# Altium schematic sheet RA8D2 MCU - Power.SchDoc
size A3; Company Name: Renesas Electronics America; CompanyURL: www.renesas.com; PageSetup: Record=PageOptions|CenterHorizontal=True|CenterVertical=True|PrintScale=1.00|XCorrection=1.00|YCorrection=1.00|PrintKind=1|BorderSize=5000000|LeftOffset=0|BottomOffset=0|Orientation=2|PaperLength=1000|PaperWidth=1000|Scale=100|PaperSource=7|PrintQuality=-4|MediaType=1|DitherType=10|PaperKind=A5 148x210mm|PrintScaleMode=1; ReleaseDate: 16.09.2025; Version: MP; SheetNumber: 10; SheetTotal: 18; VariantNumber: 0; DSheetNumber: 1
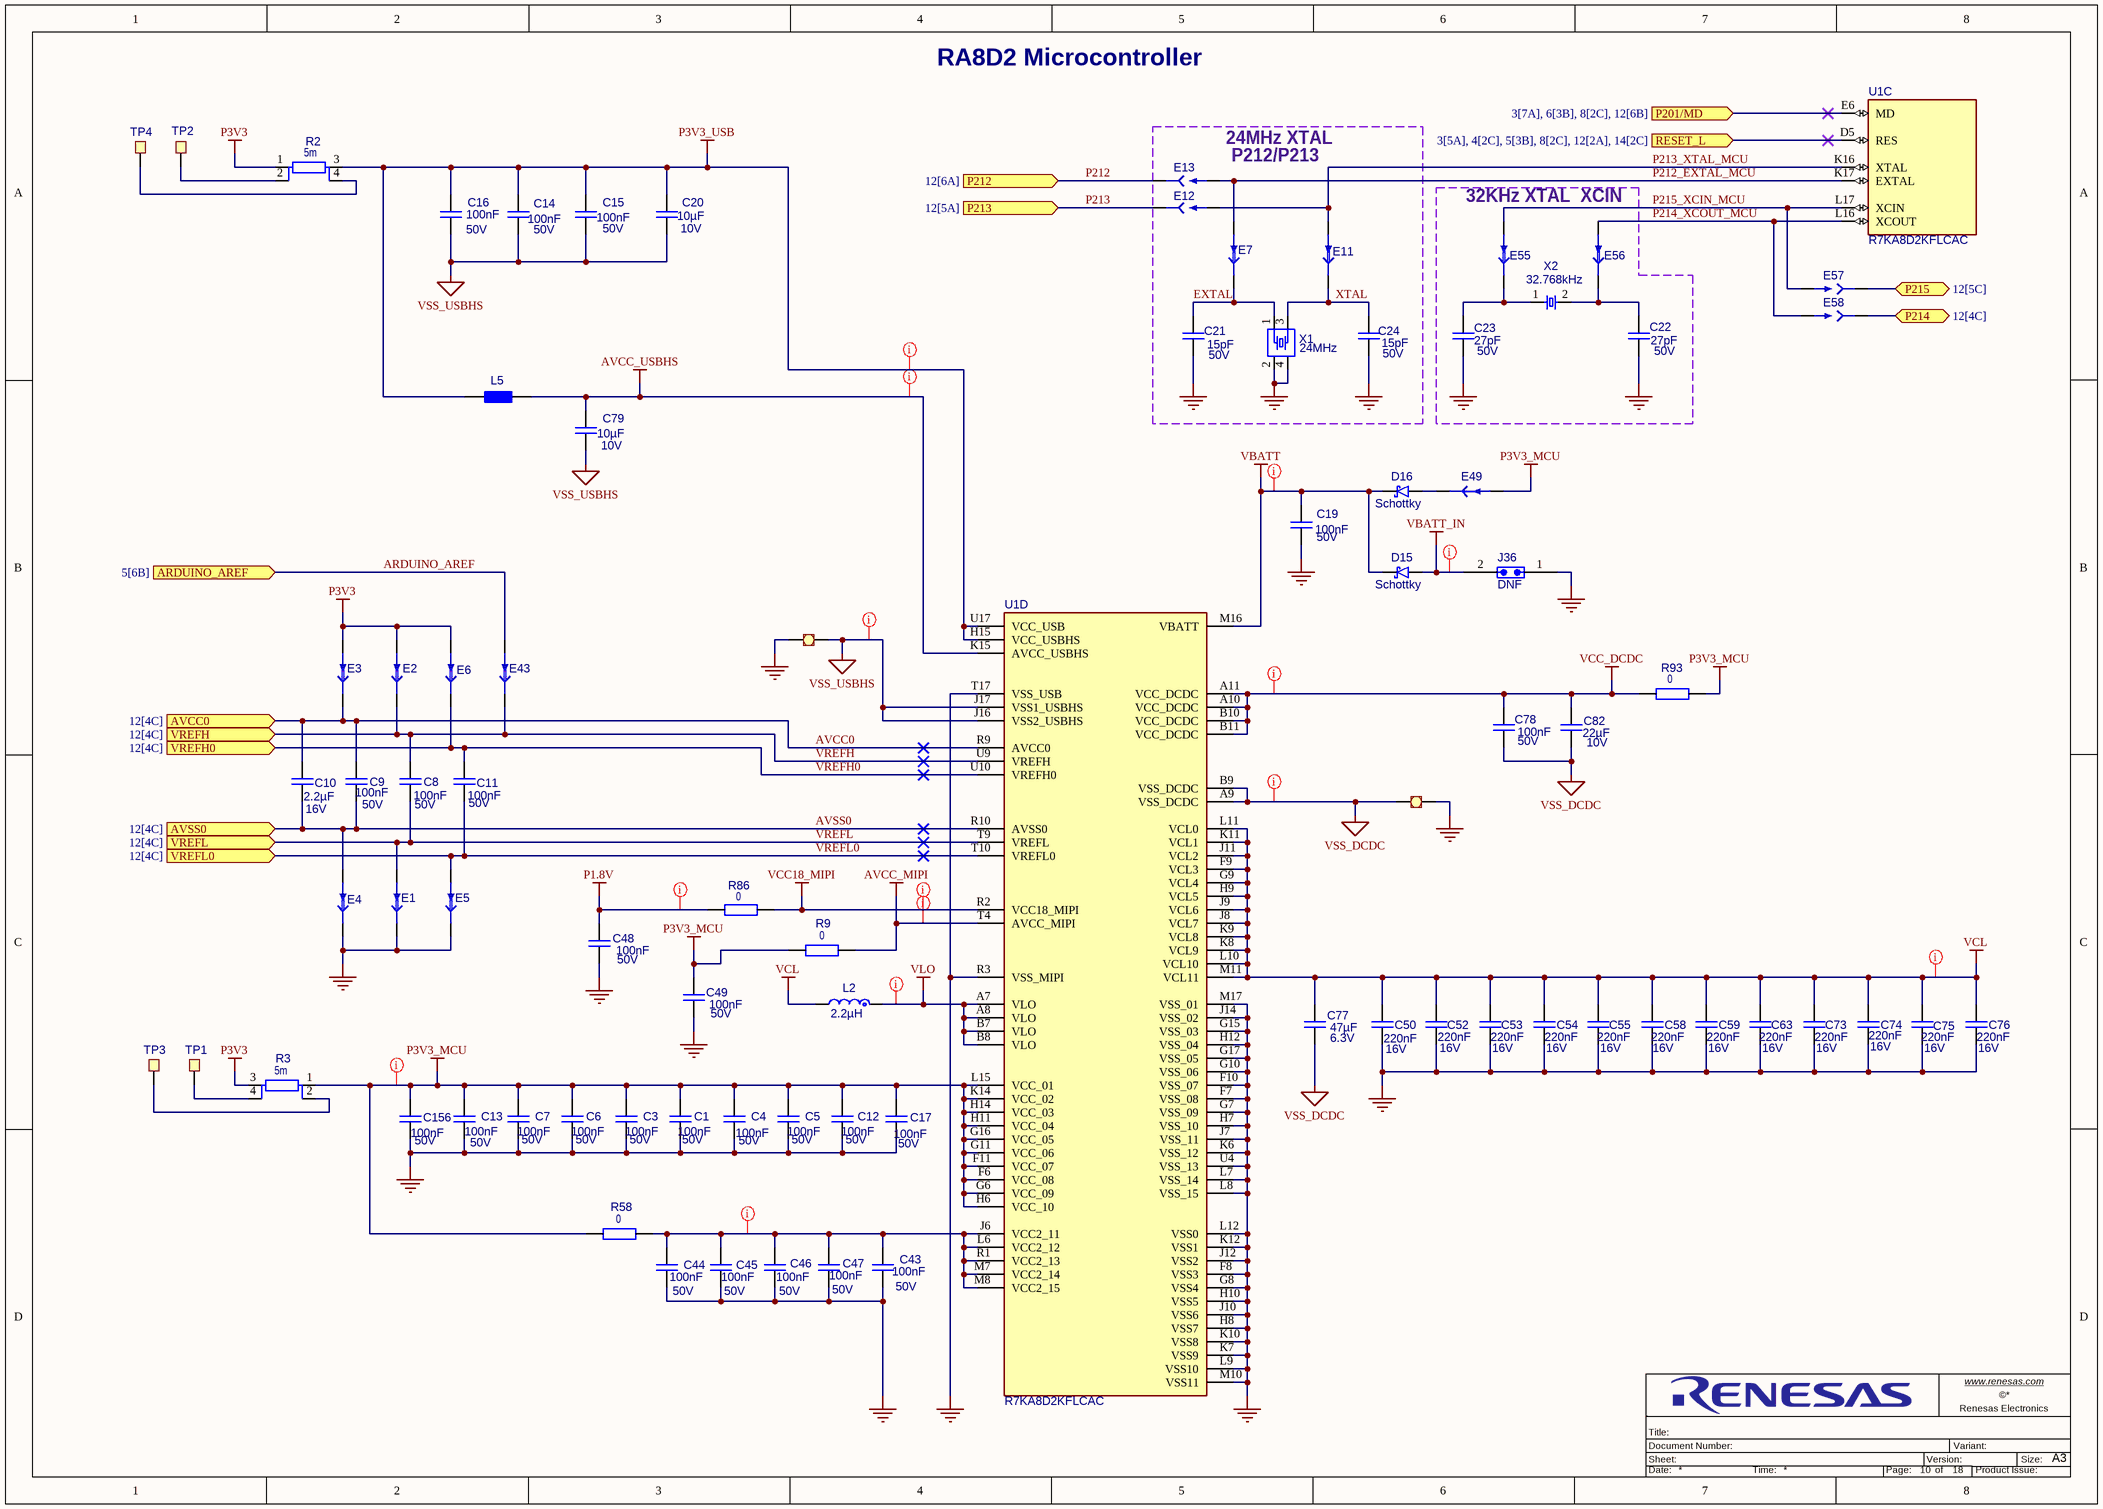
[diagram p0: RA8D2 MCU - Power.SchDoc]

## Parts
C1  value 100nF  Operating Voltage Max: 50V  [C_EIA0402_0p55]  (hidden comment: Capacitor)
C3  value 100nF  Operating Voltage Max: 50V  [C_EIA0402_0p55]  (hidden comment: Capacitor)
C4  value 100nF  Operating Voltage Max: 50V  [C_EIA0402_0p55]  (hidden comment: Capacitor)
C5  value 100nF  Operating Voltage Max: 50V  [C_EIA0402_0p55]  (hidden comment: Capacitor)
C6  value 100nF  Operating Voltage Max: 50V  [C_EIA0402_0p55]  (hidden comment: Capacitor)
C7  value 100nF  Operating Voltage Max: 50V  [C_EIA0402_0p55]  (hidden comment: Capacitor)
C8  value 100nF  Operating Voltage Max: 50V  [C_EIA0402_0p55]  (hidden comment: Capacitor)
C9  value 100nF  Operating Voltage Max: 50V  [C_EIA0402_0p55]  (hidden comment: Capacitor)
C10  value 2.2µF  Operating Voltage Max: 16V  [C_EIA0402_0p7]  (hidden comment: Capacitor)
C11  value 100nF  Operating Voltage Max: 50V  [C_EIA0402_0p55]  (hidden comment: Capacitor)
C12  value 100nF  Operating Voltage Max: 50V  [C_EIA0402_0p55]  (hidden comment: Capacitor)
C13  value 100nF  Operating Voltage Max: 50V  [C_EIA0402_0p55]  (hidden comment: Capacitor)
C14  value 100nF  Operating Voltage Max: 50V  [C_EIA0402_0p55]  (hidden comment: Capacitor)
C15  value 100nF  Operating Voltage Max: 50V  [C_EIA0402_0p55]  (hidden comment: Capacitor)
C16  value 100nF  Operating Voltage Max: 50V  [C_EIA0402_0p55]  (hidden comment: Capacitor)
C17  value 100nF  Operating Voltage Max: 50V  [C_EIA0402_0p55]  (hidden comment: Capacitor)
C19  value 100nF  Operating Voltage Max: 50V  [C_EIA0402_0p55]  (hidden comment: Capacitor)
C20  value 10µF  Operating Voltage Max: 10V  [C_EIA0402_0p7]  (hidden comment: Capacitor)
C21  value 15pF  Operating Voltage Max: 50V  [C_EIA0201_0p4]  (hidden comment: Capacitor)
C22  value 27pF  Operating Voltage Max: 50V  [C_EIA0402_0p55]  (hidden comment: Capacitor)
C23  value 27pF  Operating Voltage Max: 50V  [C_EIA0402_0p55]  (hidden comment: Capacitor)
C24  value 15pF  Operating Voltage Max: 50V  [C_EIA0201_0p4]  (hidden comment: Capacitor)
C43  value 100nF  Operating Voltage Max: 50V  [C_EIA0402_0p55]  (hidden comment: Capacitor)
C44  value 100nF  Operating Voltage Max: 50V  [C_EIA0402_0p55]  (hidden comment: Capacitor)
C45  value 100nF  Operating Voltage Max: 50V  [C_EIA0402_0p55]  (hidden comment: Capacitor)
C46  value 100nF  Operating Voltage Max: 50V  [C_EIA0402_0p55]  (hidden comment: Capacitor)
C47  value 100nF  Operating Voltage Max: 50V  [C_EIA0402_0p55]  (hidden comment: Capacitor)
C48  value 100nF  Operating Voltage Max: 50V  [C_EIA0402_0p55]  (hidden comment: Capacitor)
C49  value 100nF  Operating Voltage Max: 50V  [C_EIA0402_0p55]  (hidden comment: Capacitor)
C50  value 220nF  Operating Voltage Max: 16V  [C_EIA0402_0p55]  (hidden comment: Capacitor)
C52  value 220nF  Operating Voltage Max: 16V  [C_EIA0402_0p55]  (hidden comment: Capacitor)
C53  value 220nF  Operating Voltage Max: 16V  [C_EIA0402_0p55]  (hidden comment: Capacitor)
C54  value 220nF  Operating Voltage Max: 16V  [C_EIA0402_0p55]  (hidden comment: Capacitor)
C55  value 220nF  Operating Voltage Max: 16V  [C_EIA0402_0p55]  (hidden comment: Capacitor)
C58  value 220nF  Operating Voltage Max: 16V  [C_EIA0402_0p55]  (hidden comment: Capacitor)
C59  value 220nF  Operating Voltage Max: 16V  [C_EIA0402_0p55]  (hidden comment: Capacitor)
C63  value 220nF  Operating Voltage Max: 16V  [C_EIA0402_0p55]  (hidden comment: Capacitor)
C73  value 220nF  Operating Voltage Max: 16V  [C_EIA0402_0p55]  (hidden comment: Capacitor)
C74  value 220nF  Operating Voltage Max: 16V  [C_EIA0402_0p55]  (hidden comment: Capacitor)
C75  value 220nF  Operating Voltage Max: 16V  [C_EIA0402_0p55]  (hidden comment: Capacitor)
C76  value 220nF  Operating Voltage Max: 16V  [C_EIA0402_0p55]  (hidden comment: Capacitor)
C77  value 47µF  Operating Voltage Max: 6.3V  [C_EIA1206_1p8]  (hidden comment: GRM31CE70J476ME15L)
C78  value 100nF  Operating Voltage Max: 50V  [C_EIA0402_0p55]  (hidden comment: Capacitor)
C79  value 10µF  Operating Voltage Max: 10V  [C_EIA0402_0p7]  (hidden comment: Capacitor)
C82  value 22µF  Operating Voltage Max: 10V  [C_EIA1206_1p8]  (hidden comment: Capacitor)
C156  value 100nF  Operating Voltage Max: 50V  [C_EIA0402_0p55]  (hidden comment: Capacitor)
D15  Schottky  [roh_sod-123fl_pmdu]
D16  Schottky  [roh_sod-123fl_pmdu]
E1  TRACE_CUT_0805  [trace_cut_0805]  (value not drawn)  (net tie, no BOM)
E2  TRACE_CUT_0805  [trace_cut_0805]  (value not drawn)  (net tie, no BOM)
E3  TRACE_CUT_0805  [trace_cut_0805]  (value not drawn)  (net tie, no BOM)
E4  TRACE_CUT_0805  [trace_cut_0805]  (value not drawn)  (net tie, no BOM)
E5  TRACE_CUT_0805  [trace_cut_0805]  (value not drawn)  (net tie, no BOM)
E6  TRACE_CUT_0805  [trace_cut_0805]  (value not drawn)  (net tie, no BOM)
E7  TRACE_CUT_0805  [trace_cut_0805]  (value not drawn)  (net tie, no BOM)
E11  TRACE_CUT_0805  [trace_cut_0805]  (value not drawn)  (net tie, no BOM)
E12  SOLDER_BRIDGE_0805  [solder_bridge_0805]  (value not drawn)  (no BOM)
E13  SOLDER_BRIDGE_0805  [solder_bridge_0805]  (value not drawn)  (no BOM)
E43  TRACE_CUT_0805  [trace_cut_0805]  (value not drawn)  (net tie, no BOM)
E49  TRACE_CUT_0805  [trace_cut_0805]  (value not drawn)  (net tie, no BOM)
E55  TRACE_CUT_0805  [trace_cut_0805]  (value not drawn)  (net tie, no BOM)
E56  TRACE_CUT_0805  [trace_cut_0805]  (value not drawn)  (net tie, no BOM)
E57  SOLDER_BRIDGE_0805  [solder_bridge_0805]  (value not drawn)  (no BOM)
E58  SOLDER_BRIDGE_0805  [solder_bridge_0805]  (value not drawn)  (no BOM)
FS1  FS_Trace_120um  [force_sense_120um]  (value not drawn)  (net tie, no BOM)
FS2  FS_Trace_120um  [force_sense_120um]  (value not drawn)  (net tie, no BOM)
J36  CON_002  [wue_61300211121]  (value not drawn)
L2  value 2.2µH  [tdk_spm5020-lr]  (hidden comment: Inductor)
L5  MPZ1005S121CT000  [L_EIA0402]  (value not drawn)
R2  value 5m  [R_EIA0612]  (hidden comment: PS0612FKE070R005L)
R3  value 5m  [R_EIA0612]  (hidden comment: PS0612FKE070R005L)
R9  value 0  [R_EIA1206]  (hidden comment: Resistor)
R58  value 0  [R_EIA1206]  (hidden comment: Resistor)
R86  value 0  [R_EIA1206]  (hidden comment: Resistor)
R93  value 0  [R_EIA1206]  (hidden comment: Resistor)
TP1  TP_Mini  [key_5019]  (value not drawn)
TP2  TP_Mini  [key_5019]  (value not drawn)
TP3  TP_Mini  [key_5019]  (value not drawn)
TP4  TP_Mini  [key_5019]  (value not drawn)
U1  R7KA8D2KFLCAC  [ren_bga289_PRBG0289JA-A]  (parts C,D of 6)
X1  value 24MHz  [dio_FL]  (hidden comment: FL2400022)
X2  value 32.768kHz  [ABR_ABS07]  (hidden comment: ABS07-32.768KHZ-1-T)

## Blocks framed on the sheet
32KHz XTAL  XCIN: C22 C23 E55 E56 X2

## Ports
ARDUINO_AREF (in, see 5[6B]), AVCC0 (in, see 12[4C]), AVSS0 (in, see 12[4C]), P201/MD (in, see 3[7A], 6[3B], 8[2C], 12[6B]), P212 (in, see 12[6A]), P213 (in, see 12[5A]), P214 (bidir, see 12[4C]), P215 (bidir, see 12[5C]), RESET_L (in, see 3[5A], 4[2C], 5[3B], 8[2C], 12[2A], 14[2C]), VREFH0 (in, see 12[4C]), VREFH (in, see 12[4C]), VREFL0 (in, see 12[4C]), VREFL (in, see 12[4C])

## Nets
AVCC_MIPI: R9.2 U1.T4(AVCC_MIPI)
AVCC_USBHS: C79.1 L5.1 U1.K15(AVCC_USBHS)
GND: C1.1 C3.1 C4.1 C5.1 C6.1 C7.1 C12.1 C13.1 C17.1 C19.2 C21.2 C22.2 C23.2 C24.2 C43.1 C44.1 C45.1 C46.1 C47.1 C48.2 C49.2 C50.2 C52.2 C53.2 C54.2 C55.2 C58.2 C59.2 C63.2 C73.2 C74.2 C75.2 C76.2 C156.1 E1.1 E4.1 E5.1 FS1.1 FS2.2 J36.1 U1.F7(VSS_08) U1.F8(VSS3) U1.F10(VSS_07) U1.G7(VSS_09) U1.G8(VSS4) U1.G10(VSS_06) U1.G15(VSS_03) U1.G17(VSS_05) U1.H7(VSS_10) U1.H8(VSS7) U1.H10(VSS5) U1.H12(VSS_04) U1.J7(VSS_11) U1.J10(VSS6) U1.J12(VSS2) U1.J14(VSS_02) U1.K6(VSS_12) U1.K7(VSS9) U1.K10(VSS8) U1.K12(VSS1) U1.L7(VSS_14) U1.L8(VSS_15) U1.L9(VSS10) U1.L12(VSS0) U1.M10(VSS11) U1.M17(VSS_01) U1.R3(VSS_MIPI) U1.T17(VSS_USB) U1.U4(VSS_13) X1.2 X1.4
P1.8V: C48.1 R86.1
P3V3: E2.2 E3.2 E6.2 R2.1 R3.3
P3V3_MCU: C1.2 C3.2 C4.2 C5.2 C6.2 C7.2 C12.2 C13.2 C17.2 C49.1 C156.2 E49.2 R3.1 R9.1 R58.2 R93.2 U1.F6(VCC_08) U1.F11(VCC_07) U1.G6(VCC_09) U1.G11(VCC_06) U1.G16(VCC_05) U1.H6(VCC_10) U1.H11(VCC_04) U1.H14(VCC_03) U1.K14(VCC_02) U1.L15(VCC_01)
P3V3_USB: C14.1 C15.1 C16.1 C20.1 L5.2 R2.3 U1.H15(VCC_USBHS) U1.U17(VCC_USB)
VBATT: C19.1 D15.1(K) D16.1(K) U1.M16(VBATT)
VBATT_IN: D15.2(A) J36.2
VCC18_MIPI: R86.2 U1.R2(VCC18_MIPI)
VCC_DCDC: C78.1 C82.1 R93.1 U1.A10(VCC_DCDC) U1.A11(VCC_DCDC) U1.B10(VCC_DCDC) U1.B11(VCC_DCDC)
VCL: C50.1 C52.1 C53.1 C54.1 C55.1 C58.1 C59.1 C63.1 C73.1 C74.1 C75.1 C76.1 C77.1 L2.2 U1.F9(VCL3) U1.G9(VCL4) U1.H9(VCL5) U1.J8(VCL7) U1.J9(VCL6) U1.J11(VCL2) U1.K8(VCL9) U1.K9(VCL8) U1.K11(VCL1) U1.L10(VCL10) U1.L11(VCL0) U1.M11(VCL11)
VLO: L2.1 U1.A7(VLO) U1.A8(VLO) U1.B7(VLO) U1.B8(VLO)
VSS_DCDC: C77.2 C78.2 C82.2 FS2.1 U1.A9(VSS_DCDC) U1.B9(VSS_DCDC)
VSS_USBHS: C14.2 C15.2 C16.2 C20.2 C79.2 FS1.2 U1.J16(VSS2_USBHS) U1.J17(VSS1_USBHS)
ARDUINO_AREF: E43.2 ; port ARDUINO_AREF
AVCC0: C9.1 C10.2 E3.1 U1.R9(AVCC0) ; port AVCC0
AVSS0: C9.2 C10.1 E4.2 U1.R10(AVSS0) ; port AVSS0
EXTAL: C21.1 E7.1 X1.1
P201/MD: U1.E6(MD) ; port P201/MD
P212: E13.1 ; port P212
P212_EXTAL_MCU: E7.2 E13.2 U1.K17(EXTAL)
P213: E12.1 ; port P213
P213_XTAL_MCU: E11.2 E12.2 U1.K16(XTAL)
P214: E58.1 ; port P214
P214_XCOUT_MCU: E56.2 E58.2 U1.L16(XCOUT)
P215: E57.1 ; port P215
P215_XCIN_MCU: E55.2 E57.2 U1.L17(XCIN)
RESET_L: U1.D5(RES) ; port RESET_L
VREFH: C8.1 E2.1 E43.1 U1.U9(VREFH) ; port VREFH
VREFH0: C11.1 E6.1 U1.U10(VREFH0) ; port VREFH0
VREFL: C8.2 E1.2 U1.T9(VREFL) ; port VREFL
VREFL0: C11.2 E5.2 U1.T10(VREFL0) ; port VREFL0
XTAL: C24.1 E11.1 X1.3
NetC22_1: C22.1 E56.1 X2.2
NetC23_1: C23.1 E55.1 X2.1
NetC43_2: C43.2 C44.2 C45.2 C46.2 C47.2 R58.1 U1.J6(VCC2_11) U1.L6(VCC2_12) U1.M7(VCC2_14) U1.M8(VCC2_15) U1.R1(VCC2_13)
NetD16_2: D16.2(A) E49.1
NetR2_2: R2.2 TP2.1
NetR2_4: R2.4 TP4.1
NetR3_2: R3.2 TP3.1
NetR3_4: R3.4 TP1.1

## Layout directives
net class Power; rule Supply Nets [Voltage = 3.300]: NetC43_2, P1.8V, P3V3_MCU, VBATT, VBATT_IN, VCC_DCDC
net class Power; rule Supply Nets [Voltage = 1.200]: AVCC_USBHS, P3V3_USB, VCL, VLO
net class Power; rule Supply Nets [Voltage = 1.800]: AVCC_MIPI, VCC18_MIPI
net class Power; rule Supply Nets [Voltage = 0.000]: VSS_DCDC, VSS_USBHS

## Notes on the sheet
- RA8D2 Microcontroller
- (near E13) P212/P213
- 24MHz XTAL
- www.renesas.com <http://www.renesas.com>
- Sheet:
- Title:
- Document Number:
- Version:
- Variant:
- Renesas Electronics
- Size:
- A3
- Date:
- Time:
- Page:
- of
- Product Issue:

## Library data of the parts
C1 C3-C9 C11-C17 C19 C43-C49 C78 C156 = CAP-00003203-9: Capacitor,EIA0402,100n,50V,X7R; Tolerance: 10%; Qualification: AEC-Q200; Subtype: MLCC; Dielectric: X7R; Height: 550µm; Operating Temperature Max: 125°C; Operating Temperature Min: -55°C
C10 = CAP-00000015-4: Capacitor,EIA0402,2.2u,16V,X6S; Tolerance: 10%; Qualification: AEC-Q200; Subtype: MLCC; Dielectric: X6S; Height: 700µm; Operating Temperature Max: 105°C; Operating Temperature Min: -55°C
C20 C79 = CAP-00003447-8: Capacitor,EIA0402,10u,10V,X5R; Tolerance: 20%; Subtype: MLCC; Dielectric: X5R; Height: 700µm; Operating Temperature Max: 85°C; Operating Temperature Min: -55°C; Qualification: -
C21 C24 = CAP-00000012-4: Capacitor,EIA0201,15p,50V,C0G; Tolerance: 1%; Qualification: AEC-Q200; Subtype: MLCC; Dielectric: C0G; Height: 390µm; Operating Temperature Max: 125°C; Operating Temperature Min: -55°C
C22 C23 = CAP-00003477-9: Capacitor,EIA0402,27p,50V,C0G; Tolerance: 5%; Subtype: MLCC; Remarks: ANY EQUIVALENT; Dielectric: C0G; Height: 550µm; Operating Temperature Max: 125°C; Operating Temperature Min: -55°C; Qualification: -
C50 C52-C55 C58 C59 C63 C73-C76 = CAP-00003208-9: Capacitor,EIA0402,220n,16V,X7R; Tolerance: 10%; Qualification: AEC-Q200; Subtype: MLCC; Dielectric: X7R; Height: 550µm; Operating Temperature Max: 125°C; Operating Temperature Min: -55°C
C77 = CAP-00003371-7: Capacitor,EIA1206,47u,6.3V,X7U; Tolerance: 20%; Subtype: MLCC; Operating Temperature Max: 125°C; Operating Temperature Min: -55°C; Dielectric: X7U; Height: 1.6mm; Qualification: -
C82 = CAP-00003207-7: Capacitor,EIA1206,22u,10V,X7R; Tolerance: 10%; Qualification: AEC-Q200; Subtype: MLCC; Dielectric: X7R; Height: 1.8mm; Operating Temperature Max: 125°C; Operating Temperature Min: -55°C
D15 D16 = DIO-00000005-3: Rectifier Diode, Schottky, 1 Phase, 1 Element, 1A, 40V V(RRM), Silicon; Forward Voltage: 600mV; Qualification: AEC-Q101; Current: 1A; Height: 900µm; Operating Temperature Max: 150°C; Operating Temperature Min: -55°C; Reverse Voltage: 40V; Subtype: Schottky
E1-E7 E11 E43 E49 E55 E56 = MIS-00000000-11: Trace Cut, SMD, 0805 size; Value: TC; Pin Count: 2; Qualification: -; Subtype: Trace Cut
E12 E13 E57 E58 = MIS-00000002-7: Solder Bridge, SMD, 0805 size; Value: SB; Subtype: Solder Bridge; Qualification: -; Pin Count: 2
FS1 FS2 = MIS-00003418-12: Force-Sense Trace 120um; Subtype: Force Sense; Value: FS Trace; Pin Count: 2; Qualification: -
J36 = CON-00003283-14: Header,2way,1row,vertical,2.54mm,THT; Current: 3A; DC Resistance: 20m; Gender: male; Operating Voltage Max: 250V; Height: 8.89mm; Operating Temperature Max: 105°C; Operating Temperature Min: -40°C; Pin Count: 2; Qualification: -; DNF: DNF
L2 = IND-00000003-3: Inductor, 2.2uH, 20%, 7A, Metal-Core; DC Resistance: 37m; Frequency: 100kHz; Subtype: Fixed; Current: 7A; Tolerance: 20%; Height: 2mm; Operating Temperature Max: 125°C; Operating Temperature Min: -40°C; Qualification: -
L5 = IND-00000008-7: Ferrite Chip, 1.2A, 90mOhm DCR, 120Ohm Impedance @100MHz; Tolerance: 25%; DC Resistance: 90m; Frequency: 100MHz; Value: 120; Current: 1.2A; Height: 550µm; Operating Temperature Max: 125°C; Operating Temperature Min: -55°C; Qualification: -; Subtype: Ferrite
R2 R3 = RES-00003207-8: Current Sense Resistor,EIA0612,5m,1W; Tolerance: 1%; Subtype: Chip Resistor; Power: 1W; Height: 800µm; Operating Temperature Max: 155°C; Operating Temperature Min: -55°C; Qualification: -
R9 R58 R86 R93 = RES-00000804-8: Resistor,EIA1206,0,0.25W; Power: 250mW; Tolerance: 5%; Subtype: Chip Resistor; Operating Temperature Max: 155°C; Operating Temperature Min: -55°C; Qualification: -
TP1-TP4 = MIS-00003478-10: Testpoint Miniature; Value: TP; Pin Count: 1; Qualification: -; Subtype: Testpoint
U1 = ICS-00000098-4: Renesas RA8D2 32-bit MCU, High-performance 1 GHz Arm® Cortex®-M85 core, 250 MHz Arm® Cortex®-M33 core, up to 1 MB code MRAM, and 2 MB SRAM with ECC; Subtype: MCU/MPU; Operating Voltage Min: 1.62V; Frequency: 1GHz; Operating Voltage Max: 3.63V; Qualification: -; Operating Temperature Max: 95°C; Pin Count: 289; Operating Temperature Min: 0°C
X1 = CRY-00000005-11: Crystal, 24MHz, 10pF, 3.2x2.5; Tolerance: 10ppm; Height: 650µm; Load Capacitance: 10pF; Operating Temperature Max: -25°C; Operating Temperature Min: 85°C; Qualification: -; Subtype: Crystal
X2 = CRY-00000004-4: Crystal, 32.768kHz, 12.5pF, 3.2x1.5; Tolerance: 10ppm; Load Capacitance: 12.5pF; Operating Temperature Min: -40°C; Temperature Coefficient: -; Qualification: -; Subtype: Crystal; Operating Temperature Max: 85°C; Height: 900µm